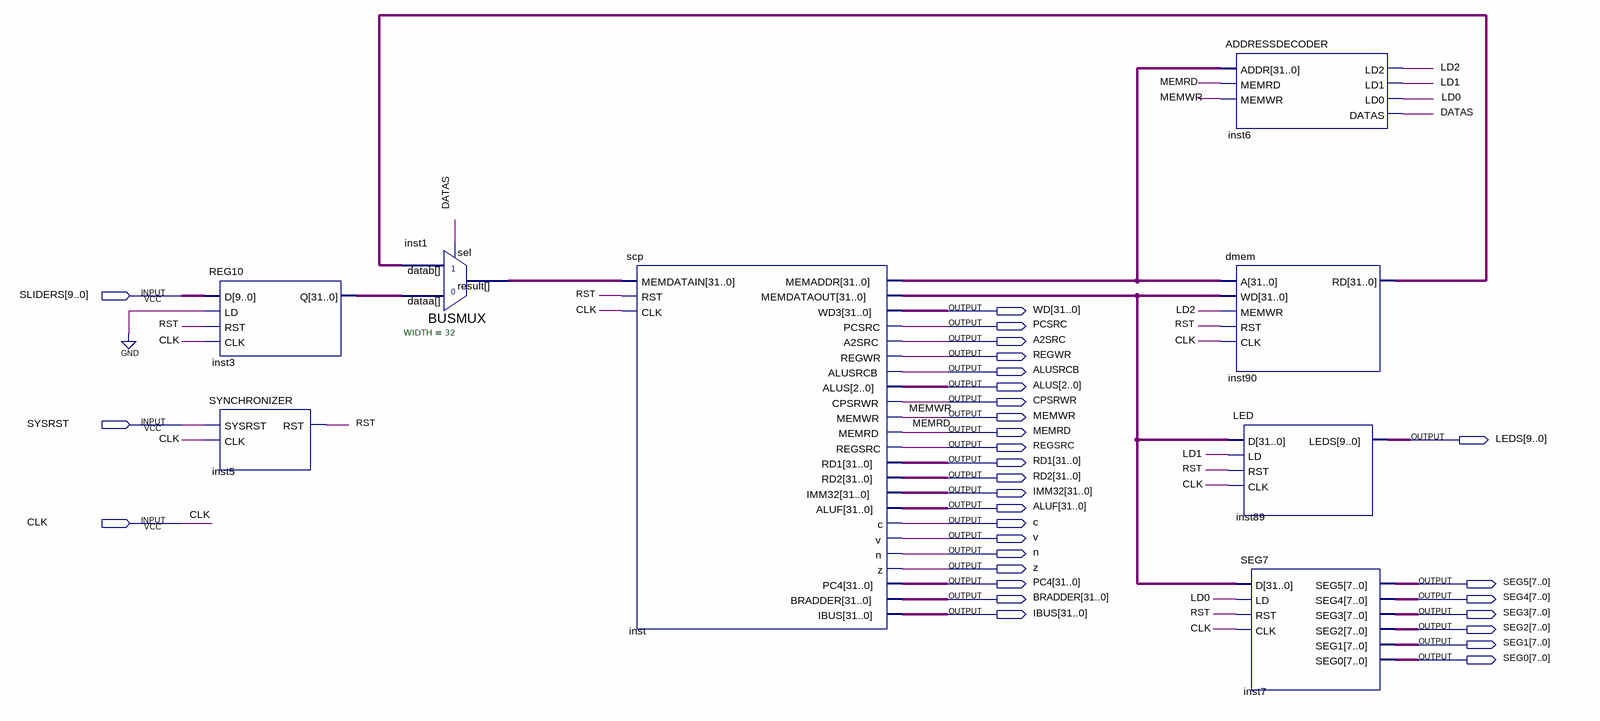
[diagram p0: schematic sheet]
// Quartus schematic system.bdf as structural Verilog: 8 symbols, 31 pins
module system (
  input  [9:0] SLIDERS,
  input  SYSRST,
  input  CLK,
  output [31:0] WD,
  output PCSRC,
  output A2SRC,
  output REGWR,
  output ALUSRCB,
  output [2:0] ALUS,
  output CPSRWR,
  output MEMWR,
  output MEMRD,
  output [9:0] LEDS,
  output REGSRC,
  output [31:0] RD1,
  output [31:0] RD2,
  output [31:0] IMM32,
  output [31:0] ALUF,
  output c,
  output v,
  output n,
  output z,
  output [31:0] PC4,
  output [7:0] SEG5,
  output [31:0] BRADDER,
  output [7:0] SEG4,
  output [31:0] IBUS,
  output [7:0] SEG3,
  output [7:0] SEG2,
  output [7:0] SEG1,
  output [7:0] SEG0
);

  wire DATAS, LD0, LD1, LD2, RST;
  wire [31:0] inst1_result, inst3_q, inst90_rd, inst_memaddr, inst_memdataout;

  REG10 inst3 (.D(SLIDERS), .LD(1'b0), .RST(RST), .CLK(CLK), .Q(inst3_q));
  SYNCHRONIZER inst5 (.SYSRST(SYSRST), .CLK(CLK), .RST(RST));
  BUSMUX #(.WIDTH(32)) inst1 (.datab(inst90_rd), .sel(DATAS), .dataa(inst3_q), .result(inst1_result));
  scp inst (
    .MEMDATAIN(inst1_result), .RST(RST), .CLK(CLK), .MEMADDR(inst_memaddr), .MEMDATAOUT(inst_memdataout),
    .WD3(WD), .PCSRC(PCSRC), .A2SRC(A2SRC), .REGWR(REGWR), .ALUSRCB(ALUSRCB), .ALUS(ALUS), .CPSRWR(CPSRWR),
    .MEMWR(MEMWR), .MEMRD(MEMRD), .REGSRC(REGSRC), .RD1(RD1), .RD2(RD2), .IMM32(IMM32), .ALUF(ALUF), .c(c),
    .v(v), .n(n), .z(z), .PC4(PC4), .BRADDER(BRADDER), .IBUS(IBUS));
  ADDRESSDECODER inst6 (
    .ADDR(inst_memaddr), .MEMRD(MEMRD), .MEMWR(MEMWR), .LD2(LD2), .LD1(LD1), .LD0(LD0), .DATAS(DATAS));
  dmem inst90 (.A(inst_memaddr), .WD(inst_memdataout), .MEMWR(LD2), .RST(RST), .CLK(CLK), .RD(inst90_rd));
  LED inst89 (.D(inst_memdataout), .LD(LD1), .RST(RST), .CLK(CLK), .LEDS(LEDS));
  SEG7 inst7 (
    .D(inst_memdataout), .LD(LD0), .RST(RST), .CLK(CLK), .SEG5(SEG5), .SEG4(SEG4), .SEG3(SEG3), .SEG2(SEG2),
    .SEG1(SEG1), .SEG0(SEG0));
endmodule
